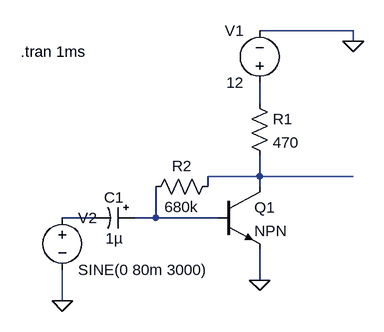
[diagram p0: schematic 18311a1930 PWM another circuit.asc]
18311a1930 PWM another circuit.asc, the LTspice schematic file:
Version 4
SHEET 1 1096 680
WIRE 352 -128 208 -128
WIRE 352 -112 352 -128
WIRE 208 -16 208 -48
WIRE 208 96 208 64
WIRE 208 96 128 96
WIRE 352 96 208 96
WIRE 128 112 128 96
WIRE 208 112 208 96
WIRE -48 160 -96 160
WIRE 48 160 48 112
WIRE 48 160 16 160
WIRE 144 160 48 160
WIRE 208 256 208 208
WIRE -96 288 -96 240
FLAG 208 256 0
FLAG -96 288 0
FLAG 352 -112 0
SYMBOL res 192 -32 R0
SYMATTR InstName R1
SYMATTR Value 470
SYMBOL res 144 96 R90
WINDOW 0 0 56 VBottom 2
WINDOW 3 32 56 VTop 2
SYMATTR InstName R2
SYMATTR Value 680k
SYMBOL polcap 16 144 R90
WINDOW 0 0 32 VBottom 2
WINDOW 3 32 32 VTop 2
SYMATTR InstName C1
SYMATTR Value 1µ
SYMATTR Description Capacitor
SYMATTR Type cap
SYMATTR SpiceLine V=10 Irms=0 Rser=2.5 Lser=0
SYMBOL voltage 208 -32 R180
WINDOW 0 24 96 Left 2
WINDOW 3 24 16 Left 2
WINDOW 123 0 0 Left 0
WINDOW 39 0 0 Left 0
SYMATTR InstName V1
SYMATTR Value 12
SYMBOL voltage -96 144 R0
WINDOW 123 0 0 Left 0
WINDOW 39 0 0 Left 0
SYMATTR InstName V2
SYMATTR Value SINE(0 80m 3000)
SYMBOL npn 144 112 R0
SYMATTR InstName Q1
TEXT -160 -96 Left 2 !.tran 1ms

The netlist it stands for:
* 18311a1930 PWM another circuit.asc
R1 N001 N002 470
R2 N002 N004 680k
C1 N004 N003 1µ V=10 Irms=0 Rser=2.5 Lser=0
V1 N001 0 12
V2 N003 0 SINE(0 80m 3000)
Q1 N002 N004 0 0 NPN
.model NPN NPN
.model PNP PNP
.lib standard.bjt
.tran 1ms
.backanno
.end